# Altium schematic sheet LED.SchDoc
size A
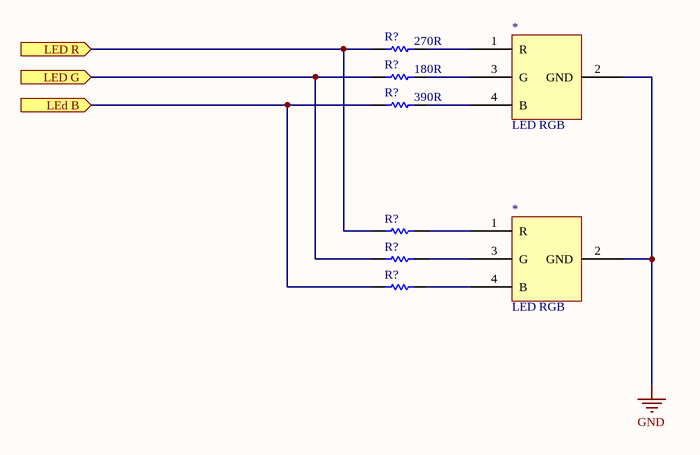
[diagram p0: LED.SchDoc]

## Parts
(Parts that share a designator on the sheet are numbered #1, #2 ... from top to bottom, then left to right.)
*#1  LED RGB
*#2  LED RGB
R?#1  270R  [AXIAL-0.3]
R?#2  180R  [AXIAL-0.3]
R?#3  390R  [AXIAL-0.3]
R?#4  (no value)  [AXIAL-0.3]
R?#5  (no value)  [AXIAL-0.3]
R?#6  (no value)  [AXIAL-0.3]

## Ports
LEd B (in), LED G (in), LED R (in)

## Nets
GND: *#1.2(GND) *#2.2(GND)
LEd B: R?#3.1 R?#6.1 ; port LEd B
LED G: R?#2.1 R?#5.1 ; port LED G
LED R: R?#1.1 R?#4.1 ; port LED R
Net*#1_1: *#1.1(R) R?#1.2
Net*#1_3: *#1.3(G) R?#2.2
Net*#1_4: *#1.4(B) R?#3.2
Net*#2_1: *#2.1(R) R?#4.2
Net*#2_3: *#2.3(G) R?#5.2
Net*#2_4: *#2.4(B) R?#6.2

## Library data of the parts
R?#1-R?#6 = Res1: Resistor; Value: 1K; Published: 8-Jun-2000; LatestRevisionDate: 17-Jul-2002; LatestRevisionNote: Re-released for DXP Platform.; PackageReference: AXIAL-0.3; Publisher: Altium Limited; PackageDescription: Axial Device, Thru-Hole; 2 Leads; 0.3 in Pin Spacing